# Altium schematic sheet MSP430MCU.SCHDOC
size A4
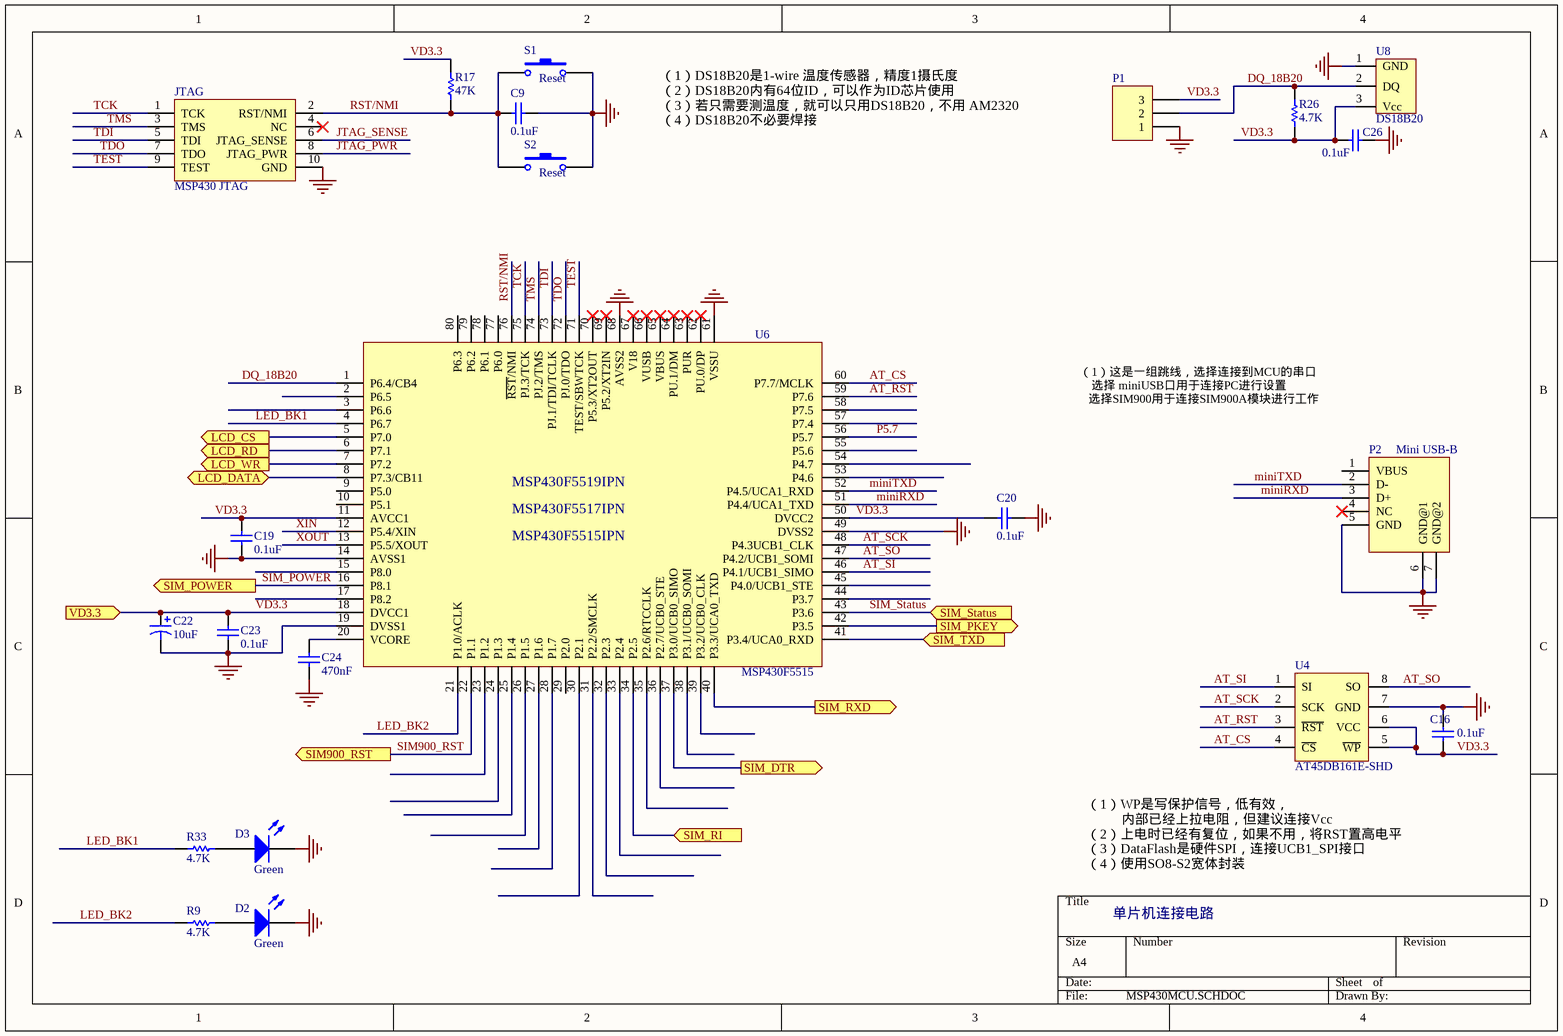
[diagram p0: MSP430MCU.SCHDOC]

## Parts
C9  value 0.1uF  [CC1608-0603]  (hidden comment: Cap Semi)
C16  value 0.1uF  [CC1608-0603]  (hidden comment: Cap Semi)
C19  value 0.1uF  [CC1608-0603]  (hidden comment: Cap Semi)
C20  value 0.1uF  [CC1608-0603]  (hidden comment: Cap Semi)
C22  value 10uF  [CC3216-1206]  (hidden comment: Cap Pol3)
C23  value 0.1uF  [CC1608-0603]  (hidden comment: Cap Semi)
C24  value 470nF  [CC1608-0603]  (hidden comment: Cap Semi)
C26  value 0.1uF  [CC1608-0603]  (hidden comment: Cap Semi)
D2  Green  [CC1608-0603]
D3  Green  [CC1608-0603]
JTAG  MSP430 JTAG  [Header10_2mm]
P1  Header 3  [HDR1X3]  (value not drawn)
P2  Mini USB-B  [MiniUSB-SOP]
R9  value 4.7K  [CR1608-0603]  (hidden comment: Res Semi)
R17  value 47K  [CR1608-0603]  (hidden comment: Res Semi)
R26  value 4.7K  [CR1608-0603]  (hidden comment: Res Semi)
R33  value 4.7K  [CR1608-0603]  (hidden comment: Res Semi)
S1  Reset  [KEY_SOT]
S2  Reset  [KEY_SOT]
U4  AT45DB161E-SHD  [SOIC8-AT45DB-S2]
U6  MSP430F5515  [PN80-MSP430F5519]
U8  DS18B20  [TO-92]

## Ports
LCD_CS (out), LCD_DATA (bidir), LCD_RD (out), LCD_WR (out), SIM900_RST (out), SIM_DTR (out), SIM_PKEY (out), SIM_POWER (out), SIM_RI (in), SIM_RXD (out), SIM_Status (in), SIM_TXD (in), VD3.3 (in)

## Nets
GND: C9.2 C16.2 C19.1 C20.2 C22.2 C23.1 C24.1 C26.1 D2.2(K) D3.2(K) JTAG.10(GND) P1.1 P2.5(GND) P2.6(GND@1) P2.7(GND@2) S1.2 S2.2 U4.7(GND) U6.14(AVSS1) U6.19(DVSS1) U6.49(DVSS2) U6.61(VSSU) U6.68(AVSS2) U8.1(GND)
AT_CS: U4.4(~{CS}) U6.60(P7.7/MCLK)
AT_RST: U4.3(~{RST}) U6.59(P7.6)
AT_SCK: U4.2(SCK) U6.48(P4.3UCB1_CLK)
AT_SI: U4.1(SI) U6.46(P4.1/UCB1_SIMO)
AT_SO: U4.8(SO) U6.47(P4.2/UCB1_SOMI)
DQ_18B20: P1.2 R26.1 U6.1(P6.4/CB4) U8.2(DQ)
JTAG_PWR: JTAG.8(JTAG_PWR)
JTAG_SENSE: JTAG.6(JTAG_SENSE)
LCD_CS: U6.5(P7.0) ; port LCD_CS
LCD_DATA: U6.8(P7.3/CB11) ; port LCD_DATA
LCD_RD: U6.6(P7.1) ; port LCD_RD
LCD_WR: U6.7(P7.2) ; port LCD_WR
LED_BK1: R33.1 U6.4(P6.7)
LED_BK2: R9.1 U6.21(P1.0/ACLK)
miniRXD: P2.3(D+) U6.51(P4.4/UCA1_TXD)
miniTXD: P2.2(D-) U6.52(P4.5/UCA1_RXD)
P5.7: U6.56(P5.7)
RST/NMI: C9.1 JTAG.2(RST/NMI) R17.1 S1.1 S2.1 U6.76(~{RST}/NMI)
SIM900_RST: U6.22(P1.1) ; port SIM900_RST
SIM_DTR: U6.37(P3.0/UCB0_SIMO) ; port SIM_DTR
SIM_PKEY: U6.42(P3.5) ; port SIM_PKEY
SIM_POWER: U6.16(P8.1) ; port SIM_POWER
SIM_RI: U6.34(P2.5) ; port SIM_RI
SIM_RXD: U6.40(P3.3/UCA0_TXD) ; port SIM_RXD
SIM_Status: U6.43(P3.6) ; port SIM_Status
SIM_TXD: U6.41(P3.4/UCA0_RXD) ; port SIM_TXD
TCK: JTAG.1(TCK) U6.75(PJ.3/TCK)
TDI: JTAG.5(TDI) U6.73(PJ.1/TDI/TCLK)
TDO: JTAG.7(TDO) U6.72(PJ.0/TDO)
TEST: JTAG.9(TEST) U6.71(TEST/SBWTCK)
TMS: JTAG.3(TMS) U6.74(PJ.2/TMS)
VD3.3: C16.1 C19.2 C20.1 C22.1 C23.2 C26.2 P1.3 R17.2 R26.2 U4.5(~{WP}) U4.6(VCC) U6.11(AVCC1) U6.18(DVCC1) U6.50(DVCC2) U8.3(Vcc) ; port VD3.3
XIN: U6.12(P5.4/XIN)
XOUT: U6.13(P5.5/XOUT)
NetC24_2: C24.2 U6.20(VCORE)
NetD2_1: D2.1(A) R9.2
NetD3_1: D3.1(A) R33.2

Not connected (* = marked no-connect by the designer): JTAG 4(NC)*; P2 1(VBUS) 4(NC)*; U6 2(P6.5) 3(P6.6) 9(P5.0) 10(P5.1) 15(P8.0) 17(P8.2) 23(P1.2) 24(P1.3) 25(P1.4) 26(P1.5) 27(P1.6) 28(P1.7) 29(P2.0) 30(P2.1) 31(P2.2/SMCLK) 32(P2.3) 33(P2.4) 35(P2.6/RTCCLK) 36(P2.7/UCB0_STE) 38(P3.1/UCB0_SOMI) 39(P3.2/UCB0_CLK) 44(P3.7) 45(P4.0/UCB1_STE) 53(P4.6) 54(P4.7) 55(P5.6) 57(P7.4) 58(P7.5) 62(PU.0/DP)* 63(PUR)* 64(PU.1/DM)* 65(VBUS)* 66(VUSB)* 67(V18)* 69(P5.2/XT2IN)* 70(P5.3/XT2OUT)* 77(P6.0) 78(P6.1) 79(P6.2) 80(P6.3)

## Notes on the sheet
- （1）DS18B20是1-wire 温度传感器，精度1摄氏度
  （2）DS18B20内有64位ID，可以作为ID芯片使用
  （3）若只需要测温度，就可以只用DS18B20，不用 AM2320
  （4）DS18B20不必要焊接
- (near P2) （1）这是一组跳线，选择连接到MCU的串口
  选择 miniUSB口用于连接PC进行设置
  选择SIM900用于连接SIM900A模块进行工作
- （1）WP是写保护信号，低有效，
  内部已经上拉电阻，但建议连接Vcc
  （2）上电时已经有复位，如果不用，将RST置高电平
  （3）DataFlash是硬件SPI，连接UCB1_SPI接口
  （4）使用SO8-S2宽体封装
- 单片机连接电路
- (in symbol MSP430F5519) MSP430F5519IPN; MSP430F5517IPN; MSP430F5515IPN

## Library data of the parts
C9 C16 C19 C20 C23 C24 C26 = Cap Semi: Capacitor (Semiconductor SIM Model); Published: 8-Jun-2000; LatestRevisionDate: 17-Jul-2002; LatestRevisionNote: Re-released for DXP Platform.; PackageReference: C1206; Publisher: Altium Limited
C22 = Cap Pol3: Polarized Capacitor (Surface Mount); Published: 8-Jun-2000; LatestRevisionDate: 17-Jul-2002; LatestRevisionNote: Re-released for DXP Platform.; PackageReference: C0805; Publisher: Altium Limited
D2 D3 = LED2: Typical RED, GREEN, YELLOW, AMBER GaAs LED; Published: 8-Jun-2000; LatestRevisionDate: 17-Jul-2002; LatestRevisionNote: Re-released for DXP Platform.; Publisher: Altium Limited
JTAG = MSP430_JTAG2mm
P1 = Header 3: Header, 3-Pin; LatestRevisionDate: 17-Jul-2002; LatestRevisionNote: Re-released for DXP Platform.; Publisher: Altium Limited
R9 R17 R26 R33 = Res Semi: Semiconductor Resistor; Published: 8-Jun-2000; LatestRevisionDate: 17-Jul-2002; LatestRevisionNote: Re-released for DXP Platform.; Publisher: Altium Limited
S1 S2 = SW-PB: Switch; Published: 24-Mar-1999; LatestRevisionDate: 17-Jul-2002; LatestRevisionNote: Re-released for DXP Platform.; Publisher: Altium Limited
U4 = AT45DB161D: 16MBits Dataflash; Compay: ATMEL
U6 = MSP430F5519: MSP430F5519/17/15
U8 = DS18B20: 1-Wire Digital Thermometer